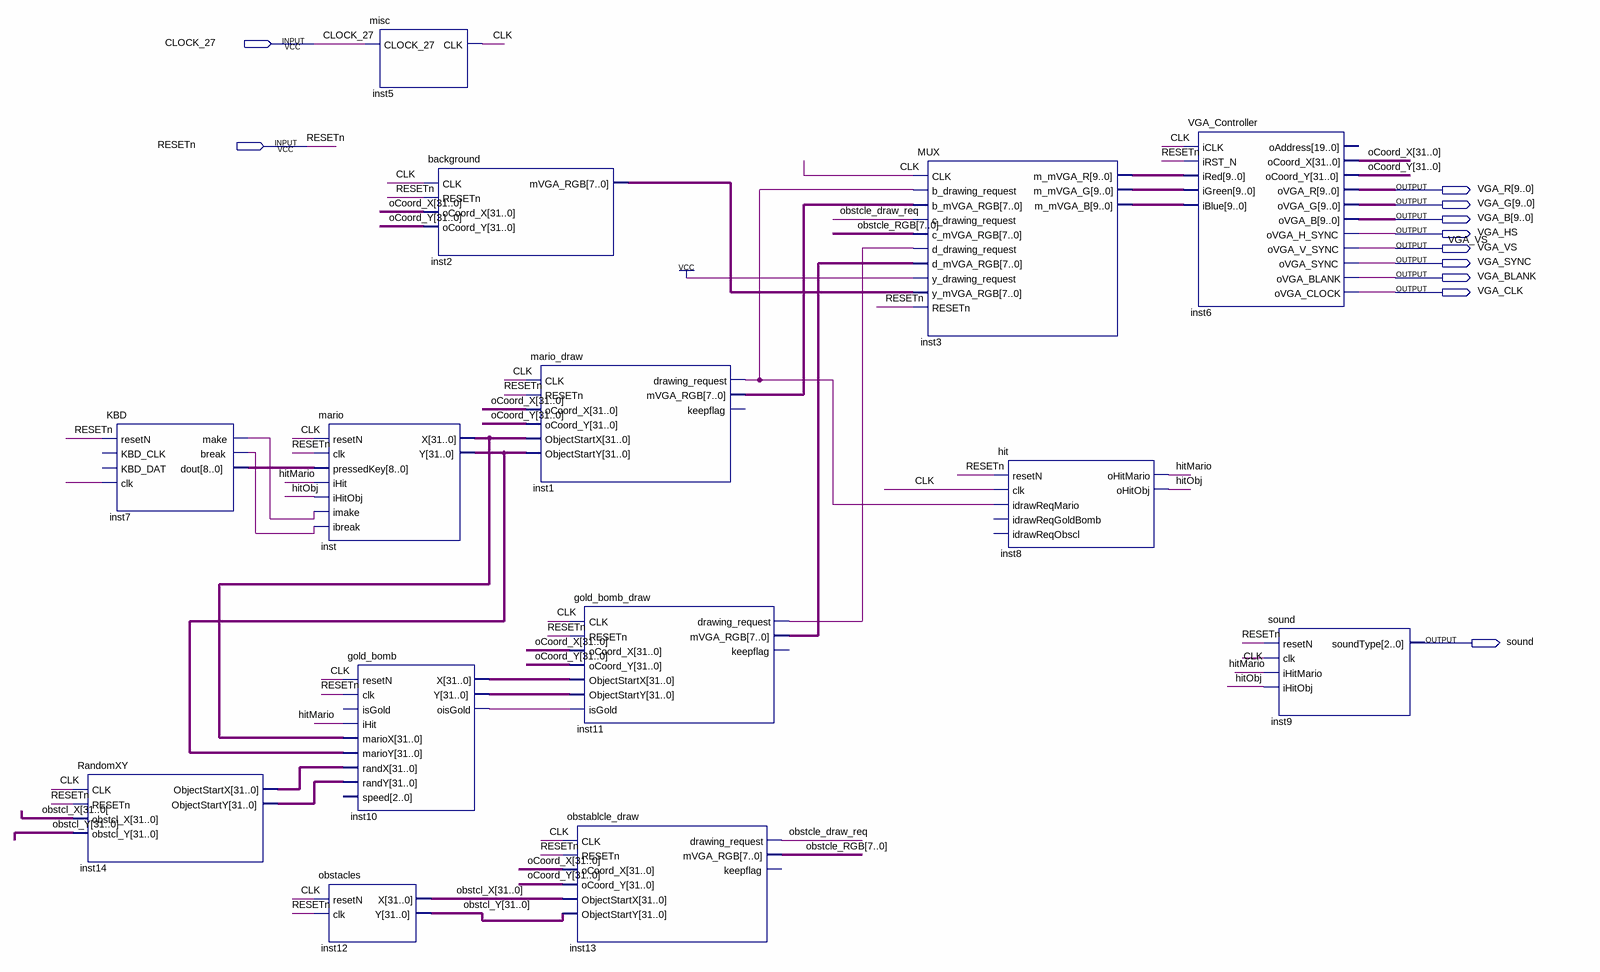
[diagram p0: schematic sheet]
// Quartus schematic SuperMario.bdf as structural Verilog: 14 symbols, 11 pins
module SuperMario (
  input  CLOCK_27,
  input  RESETn,
  output [9:0] VGA_R,
  output [9:0] VGA_G,
  output [9:0] VGA_B,
  output VGA_HS,
  output VGA_VS,
  output VGA_SYNC,
  output VGA_BLANK,
  output VGA_CLK,
  output sound
);

  wire CLK, hitMario, hitObj, inst1_drawing_request, inst7_break, inst7_make, inst10_oisgold,
       inst11_drawing_request, \obstcl_X[31..0[ , obstcle_draw_req, undriven;
  wire [7:0] inst1_mvga_rgb, inst2_mvga_rgb, inst11_mvga_rgb, obstcle_RGB;
  wire [8:0] inst7_dout;
  wire [9:0] inst3_m_mvga_b, inst3_m_mvga_g, inst3_m_mvga_r;
  wire [31:0] inst10_x, inst10_y, inst14_objectstartx, inst14_objectstarty, inst_x, inst_y, obstcl_X,
       obstcl_Y, oCoord_X, oCoord_Y;

  KBD inst7 (
    .resetN(RESETn), .clk(undriven), .make(inst7_make), .\break (inst7_break), .dout(inst7_dout));  // open: KBD_CLK, KBD_DAT
  RandomXY inst14 (
    .CLK(CLK), .RESETn(RESETn), .obstcl_X({32{\obstcl_X[31..0[ }}), .obstcl_Y(obstcl_Y),
    .ObjectStartX(inst14_objectstartx), .ObjectStartY(inst14_objectstarty));
  mario inst (
    .resetN(CLK), .clk(RESETn), .pressedKey(inst7_dout), .iHit(hitMario), .iHitObj(hitObj),
    .imake(inst7_make), .ibreak(inst7_break), .X(inst_x), .Y(inst_y));
  obstacles inst12 (.resetN(CLK), .clk(RESETn), .X(obstcl_X), .Y(obstcl_Y));
  misc inst5 (.CLOCK_27(CLOCK_27), .CLK(CLK));
  gold_bomb inst10 (
    .resetN(CLK), .clk(RESETn), .iHit(hitMario), .marioX(inst_x), .marioY(inst_y),
    .randX(inst14_objectstartx), .randY(inst14_objectstarty), .X(inst10_x), .Y(inst10_y),
    .oisGold(inst10_oisgold));  // open: isGold, speed
  background inst2 (.CLK(CLK), .RESETn(RESETn), .oCoord_X(oCoord_X), .oCoord_Y(oCoord_Y), .mVGA_RGB(inst2_mvga_rgb));
  mario_draw inst1 (
    .CLK(CLK), .RESETn(RESETn), .oCoord_X(oCoord_X), .oCoord_Y(oCoord_Y), .ObjectStartX(inst_x),
    .ObjectStartY(inst_y), .drawing_request(inst1_drawing_request), .mVGA_RGB(inst1_mvga_rgb));  // open: keepflag
  gold_bomb_draw inst11 (
    .CLK(CLK), .RESETn(RESETn), .oCoord_X(oCoord_X), .oCoord_Y(oCoord_Y), .ObjectStartX(inst10_x),
    .ObjectStartY(inst10_y), .isGold(inst10_oisgold), .drawing_request(inst11_drawing_request),
    .mVGA_RGB(inst11_mvga_rgb));  // open: keepflag
  obstablcle_draw inst13 (
    .CLK(CLK), .RESETn(RESETn), .oCoord_X(oCoord_X), .oCoord_Y(oCoord_Y), .ObjectStartX(obstcl_X),
    .ObjectStartY(obstcl_Y), .drawing_request(obstcle_draw_req), .mVGA_RGB(obstcle_RGB));  // open: keepflag
  MUX inst3 (
    .CLK(CLK), .b_drawing_request(inst1_drawing_request), .b_mVGA_RGB(inst1_mvga_rgb),
    .c_drawing_request(obstcle_draw_req), .c_mVGA_RGB(obstcle_RGB),
    .d_drawing_request(inst11_drawing_request), .d_mVGA_RGB(inst11_mvga_rgb), .y_drawing_request(1'b1),
    .y_mVGA_RGB(inst2_mvga_rgb), .RESETn(RESETn), .m_mVGA_R(inst3_m_mvga_r), .m_mVGA_G(inst3_m_mvga_g),
    .m_mVGA_B(inst3_m_mvga_b));
  hit inst8 (
    .resetN(RESETn), .clk(CLK), .idrawReqMario(inst1_drawing_request), .oHitMario(hitMario), .oHitObj(hitObj));  // open: idrawReqGoldBomb, idrawReqObscl
  VGA_Controller inst6 (
    .iCLK(CLK), .iRST_N(RESETn), .iRed(inst3_m_mvga_r), .iGreen(inst3_m_mvga_g), .iBlue(inst3_m_mvga_b),
    .oCoord_X(oCoord_X), .oCoord_Y(oCoord_Y), .oVGA_R(VGA_R), .oVGA_G(VGA_G), .oVGA_B(VGA_B),
    .oVGA_H_SYNC(VGA_HS), .oVGA_V_SYNC(VGA_VS), .oVGA_SYNC(VGA_SYNC), .oVGA_BLANK(VGA_BLANK),
    .oVGA_CLOCK(VGA_CLK));  // open: oAddress
  sound inst9 (.resetN(RESETn), .clk(CLK), .iHitMario(hitMario), .iHitObj(hitObj), .soundType(sound));
endmodule
